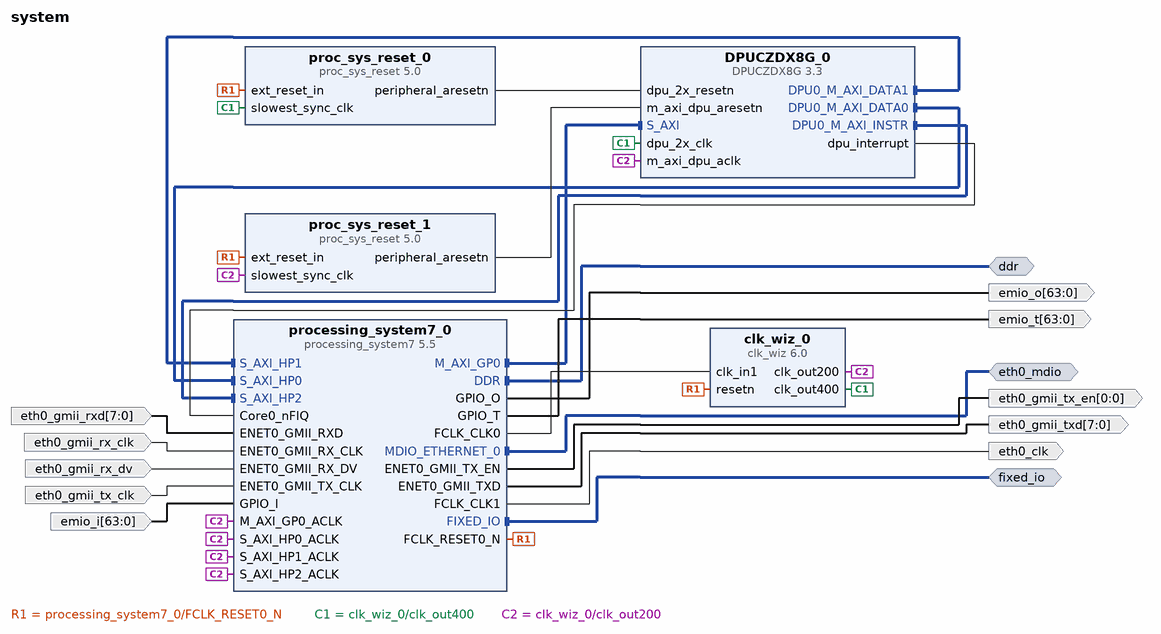
[diagram p0: block diagram of the top level]
# Vivado block design system, xc7z010clg400-1, Vivado 2020.2
create_bd_design system

create_bd_intf_port -mode Master -vlnv xilinx.com:interface:ddrx_rtl:1.0 ddr
create_bd_intf_port -mode Master -vlnv xilinx.com:interface:mdio_rtl:1.0 eth0_mdio
create_bd_intf_port -mode Master -vlnv xilinx.com:display_processing_system7:fixedio_rtl:1.0 fixed_io
create_bd_port -dir I -from 63 -to 0 emio_i
create_bd_port -dir O -from 63 -to 0 emio_o
create_bd_port -dir O -from 63 -to 0 emio_t
create_bd_port -dir O -type clk eth0_clk
set_property -dict {CONFIG.FREQ_HZ 25000000} [get_bd_ports eth0_clk]
create_bd_port -dir I -type clk eth0_gmii_rx_clk
create_bd_port -dir I eth0_gmii_rx_dv
create_bd_port -dir I -from 7 -to 0 eth0_gmii_rxd
create_bd_port -dir I -type clk eth0_gmii_tx_clk
create_bd_port -dir O -from 0 -to 0 eth0_gmii_tx_en
create_bd_port -dir O -from 7 -to 0 eth0_gmii_txd

create_bd_cell -type ip -vlnv xilinx.com:ip:processing_system7:5.5 processing_system7_0
set_property -dict [list \
  CONFIG.PCW_CORE0_FIQ_INTR 1 \
  CONFIG.PCW_ENET0_ENET0_IO EMIO \
  CONFIG.PCW_ENET0_GRP_MDIO_ENABLE 1 \
  CONFIG.PCW_ENET0_GRP_MDIO_IO EMIO \
  CONFIG.PCW_ENET0_PERIPHERAL_ENABLE 1 \
  CONFIG.PCW_ENET0_PERIPHERAL_FREQMHZ {100 Mbps} \
  CONFIG.PCW_ENET0_RESET_ENABLE 0 \
  CONFIG.PCW_ENET_RESET_ENABLE 1 \
  CONFIG.PCW_ENET_RESET_SELECT {Share reset pin} \
  CONFIG.PCW_EN_CLK1_PORT 1 \
  CONFIG.PCW_FCLK_CLK1_BUF TRUE \
  CONFIG.PCW_FPGA0_PERIPHERAL_FREQMHZ 100 \
  CONFIG.PCW_FPGA1_PERIPHERAL_FREQMHZ 25 \
  CONFIG.PCW_FPGA_FCLK1_ENABLE 1 \
  CONFIG.PCW_GPIO_EMIO_GPIO_ENABLE 1 \
  CONFIG.PCW_GPIO_EMIO_GPIO_IO 64 \
  CONFIG.PCW_GPIO_MIO_GPIO_ENABLE 1 \
  CONFIG.PCW_GPIO_MIO_GPIO_IO MIO \
  CONFIG.PCW_I2C_RESET_ENABLE 1 \
  CONFIG.PCW_QSPI_PERIPHERAL_ENABLE 0 \
  CONFIG.PCW_SD0_GRP_CD_ENABLE 1 \
  CONFIG.PCW_SD0_GRP_CD_IO {MIO 34} \
  CONFIG.PCW_SD0_GRP_WP_ENABLE 0 \
  CONFIG.PCW_SD0_PERIPHERAL_ENABLE 1 \
  CONFIG.PCW_SD0_SD0_IO {MIO 40 .. 45} \
  CONFIG.PCW_SDIO_PERIPHERAL_FREQMHZ 20 \
  CONFIG.PCW_S_AXI_HP2_DATA_WIDTH 32 \
  CONFIG.PCW_UART1_PERIPHERAL_ENABLE 1 \
  CONFIG.PCW_UART1_UART1_IO {MIO 24 .. 25} \
  CONFIG.PCW_UART_PERIPHERAL_FREQMHZ 100 \
  CONFIG.PCW_UIPARAM_DDR_BUS_WIDTH {16 Bit} \
  CONFIG.PCW_UIPARAM_DDR_PARTNO {MT41K128M16 HA-15E} \
  CONFIG.PCW_USB_RESET_ENABLE 1 \
  CONFIG.PCW_USE_FABRIC_INTERRUPT 1 \
  CONFIG.PCW_USE_S_AXI_HP0 1 \
  CONFIG.PCW_USE_S_AXI_HP1 1 \
  CONFIG.PCW_USE_S_AXI_HP2 1 \
] [get_bd_cells processing_system7_0]
# 214 more settings of processing_system7_0 are not shown: defaults, MIO pin electricals, DDR timing, and values the tool derives
create_bd_cell -type ip -vlnv xilinx.com:ip:DPUCZDX8G:3.3 DPUCZDX8G_0
set_property -dict [list \
  CONFIG.ARCH 512 \
  CONFIG.ARCH_IMG_BKGRP 2 \
  CONFIG.CONV_DSP_ACCU_ENA 1 \
  CONFIG.CONV_RELU_ADDON 2 \
  CONFIG.DWCV_ENA 0 \
  CONFIG.LOAD_AUGM 0 \
  CONFIG.POOL_AVERAGE 0 \
  CONFIG.S_AXI_CLK_INDEPENDENT 0 \
  CONFIG.TIME_DAY 18 \
  CONFIG.TIME_HOUR 13 \
  CONFIG.TIME_MONTH 7 \
  CONFIG.TIME_QUARTER 2 \
  CONFIG.TIME_YEAR 21 \
] [get_bd_cells DPUCZDX8G_0]
create_bd_cell -type ip -vlnv xilinx.com:ip:clk_wiz:6.0 clk_wiz_0
set_property -dict [list \
  CONFIG.CLKIN1_JITTER_PS 100.0 \
  CONFIG.CLKOUT1_DRIVES BUFG \
  CONFIG.CLKOUT1_JITTER 90.074 \
  CONFIG.CLKOUT1_PHASE_ERROR 87.180 \
  CONFIG.CLKOUT1_REQUESTED_OUT_FREQ 400 \
  CONFIG.CLKOUT2_DRIVES BUFG \
  CONFIG.CLKOUT2_JITTER 102.086 \
  CONFIG.CLKOUT2_PHASE_ERROR 87.180 \
  CONFIG.CLKOUT2_REQUESTED_OUT_FREQ 200 \
  CONFIG.CLKOUT2_USED true \
  CONFIG.CLKOUT3_DRIVES BUFG \
  CONFIG.CLKOUT3_JITTER 115.831 \
  CONFIG.CLKOUT3_PHASE_ERROR 87.180 \
  CONFIG.CLKOUT3_USED false \
  CONFIG.CLKOUT4_DRIVES BUFG \
  CONFIG.CLKOUT5_DRIVES BUFG \
  CONFIG.CLKOUT6_DRIVES BUFG \
  CONFIG.CLKOUT7_DRIVES BUFG \
  CONFIG.CLK_OUT1_PORT clk_out400 \
  CONFIG.CLK_OUT2_PORT clk_out200 \
  CONFIG.CLK_OUT3_PORT clk_out100 \
  CONFIG.MMCM_BANDWIDTH OPTIMIZED \
  CONFIG.MMCM_CLKFBOUT_MULT_F 12 \
  CONFIG.MMCM_CLKIN1_PERIOD 10.000 \
  CONFIG.MMCM_CLKIN2_PERIOD 10.000 \
  CONFIG.MMCM_CLKOUT0_DIVIDE_F 3 \
  CONFIG.MMCM_CLKOUT1_DIVIDE 6 \
  CONFIG.MMCM_CLKOUT2_DIVIDE 1 \
  CONFIG.MMCM_COMPENSATION ZHOLD \
  CONFIG.NUM_OUT_CLKS 2 \
  CONFIG.PLL_CLKIN_PERIOD 10.000 \
  CONFIG.PRIMITIVE PLL \
  CONFIG.PRIM_IN_FREQ 100 \
  CONFIG.RESET_PORT resetn \
  CONFIG.RESET_TYPE ACTIVE_LOW \
] [get_bd_cells clk_wiz_0]
create_bd_cell -type ip -vlnv xilinx.com:ip:proc_sys_reset:5.0 proc_sys_reset_0
create_bd_cell -type ip -vlnv xilinx.com:ip:proc_sys_reset:5.0 proc_sys_reset_1

# ---- connections ----

connect_bd_intf_net [get_bd_intf_ports ddr] [get_bd_intf_pins processing_system7_0/DDR]
connect_bd_intf_net [get_bd_intf_ports eth0_mdio] [get_bd_intf_pins processing_system7_0/MDIO_ETHERNET_0]
connect_bd_intf_net [get_bd_intf_pins processing_system7_0/S_AXI_HP1] [get_bd_intf_pins DPUCZDX8G_0/DPU0_M_AXI_DATA1]
connect_bd_intf_net [get_bd_intf_pins processing_system7_0/S_AXI_HP0] [get_bd_intf_pins DPUCZDX8G_0/DPU0_M_AXI_DATA0]
connect_bd_intf_net [get_bd_intf_pins DPUCZDX8G_0/S_AXI] [get_bd_intf_pins processing_system7_0/M_AXI_GP0]
connect_bd_intf_net [get_bd_intf_pins processing_system7_0/S_AXI_HP2] [get_bd_intf_pins DPUCZDX8G_0/DPU0_M_AXI_INSTR]
connect_bd_intf_net [get_bd_intf_ports fixed_io] [get_bd_intf_pins processing_system7_0/FIXED_IO]
connect_bd_net -net ENET0_GMII_RXD_0_1 [get_bd_ports eth0_gmii_rxd] [get_bd_pins processing_system7_0/ENET0_GMII_RXD]
connect_bd_net -net ENET0_GMII_RX_CLK_0_1 [get_bd_ports eth0_gmii_rx_clk] [get_bd_pins processing_system7_0/ENET0_GMII_RX_CLK]
connect_bd_net -net ENET0_GMII_RX_DV_0_1 [get_bd_ports eth0_gmii_rx_dv] [get_bd_pins processing_system7_0/ENET0_GMII_RX_DV]
connect_bd_net -net ENET0_GMII_TX_CLK_0_1 [get_bd_ports eth0_gmii_tx_clk] [get_bd_pins processing_system7_0/ENET0_GMII_TX_CLK]
connect_bd_net -net GPIO_I_0_1 [get_bd_ports emio_i] [get_bd_pins processing_system7_0/GPIO_I]
connect_bd_net [get_bd_pins processing_system7_0/ENET0_GMII_TXD] [get_bd_ports eth0_gmii_txd]
connect_bd_net [get_bd_pins processing_system7_0/ENET0_GMII_TX_EN] [get_bd_ports eth0_gmii_tx_en]
connect_bd_net [get_bd_pins processing_system7_0/GPIO_O] [get_bd_ports emio_o]
connect_bd_net [get_bd_pins processing_system7_0/GPIO_T] [get_bd_ports emio_t]
connect_bd_net [get_bd_pins processing_system7_0/FCLK_RESET0_N] \
  [get_bd_pins proc_sys_reset_0/ext_reset_in] [get_bd_pins proc_sys_reset_1/ext_reset_in] [get_bd_pins clk_wiz_0/resetn]
connect_bd_net -net clk_wiz_0_clk_out2x [get_bd_pins clk_wiz_0/clk_out400] \
  [get_bd_pins DPUCZDX8G_0/dpu_2x_clk] [get_bd_pins proc_sys_reset_0/slowest_sync_clk]
connect_bd_net [get_bd_pins clk_wiz_0/clk_out200] \
  [get_bd_pins DPUCZDX8G_0/m_axi_dpu_aclk] [get_bd_pins proc_sys_reset_1/slowest_sync_clk] \
  [get_bd_pins processing_system7_0/S_AXI_HP2_ACLK] [get_bd_pins processing_system7_0/S_AXI_HP1_ACLK] \
  [get_bd_pins processing_system7_0/S_AXI_HP0_ACLK] [get_bd_pins processing_system7_0/M_AXI_GP0_ACLK]
connect_bd_net [get_bd_pins proc_sys_reset_0/peripheral_aresetn] [get_bd_pins DPUCZDX8G_0/dpu_2x_resetn]
connect_bd_net [get_bd_pins proc_sys_reset_1/peripheral_aresetn] [get_bd_pins DPUCZDX8G_0/m_axi_dpu_aresetn]
connect_bd_net [get_bd_pins DPUCZDX8G_0/dpu_interrupt] [get_bd_pins processing_system7_0/Core0_nFIQ]
connect_bd_net [get_bd_pins processing_system7_0/FCLK_CLK1] [get_bd_ports eth0_clk]
connect_bd_net [get_bd_pins processing_system7_0/FCLK_CLK0] [get_bd_pins clk_wiz_0/clk_in1]

# ---- address map ----
assign_bd_address -offset 0x0000000000 -range 16M -target_address_space [get_bd_addr_spaces DPUCZDX8G_0/DPU0_M_AXI_DATA0] [get_bd_addr_segs processing_system7_0/S_AXI_HP0/HP0_DDR_LOWOCM]
assign_bd_address -offset 0x0000000000 -range 16M -target_address_space [get_bd_addr_spaces DPUCZDX8G_0/DPU0_M_AXI_DATA1] [get_bd_addr_segs processing_system7_0/S_AXI_HP1/HP1_DDR_LOWOCM]
assign_bd_address -offset 0x0000000000 -range 16M -target_address_space [get_bd_addr_spaces DPUCZDX8G_0/DPU0_M_AXI_INSTR] [get_bd_addr_segs processing_system7_0/S_AXI_HP2/HP2_DDR_LOWOCM]
assign_bd_address -offset 0x40000000 -range 16M -target_address_space [get_bd_addr_spaces processing_system7_0/Data] [get_bd_addr_segs DPUCZDX8G_0/S_AXI/reg0]

validate_bd_design
save_bd_design
